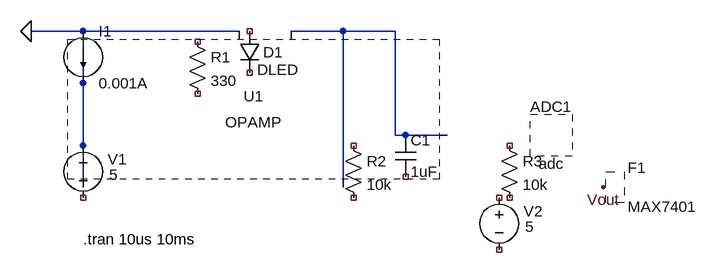
[diagram p0: schematic simv2.asc]
simv2.asc, the LTspice schematic file:
Version 4
SHEET 1 880 680
WIRE -240 0 -320 0
WIRE 0 0 -240 0
WIRE 160 0 80 0
WIRE 240 0 160 0
WIRE -240 160 -240 0
WIRE 160 160 160 0
WIRE 240 160 240 0
WIRE 320 160 240 160
WIRE -240 240 -240 160
WIRE 160 240 160 160
FLAG -320 0 0
SYMBOL voltage -240 160 R0
WINDOW 0 38 37 Left 0
WINDOW 3 40 61 Left 0
SYMATTR InstName V1
SYMATTR Value 5
SYMBOL res -80 0 R0
SYMATTR InstName R1
SYMATTR Value 330
SYMBOL diode 0 0 R0
WINDOW 0 37 32 Left 0
WINDOW 3 28 59 Left 0
SYMATTR InstName D1
SYMATTR Value DLED
SYMBOL current -240 0 R0
SYMATTR InstName I1
SYMATTR Value 0.001A
SYMBOL res 160 160 R0
SYMATTR InstName R2
SYMATTR Value 10k
SYMBOL cap 240 160 R0
SYMATTR InstName C1
SYMATTR Value 1uF
SYMBOL opamp 320 160 R0
SYMATTR InstName U1
SYMATTR Value OPAMP
SYMBOL res 400 160 R0
SYMATTR InstName R3
SYMATTR Value 10k
SYMBOL voltage 400 240 R0
WINDOW 0 38 37 Left 0
WINDOW 3 40 61 Left 0
SYMATTR InstName V2
SYMATTR Value 5
SYMBOL adc 480 160 R0
SYMATTR InstName ADC1
SYMBOL filter 560 160 R0
SYMATTR InstName F1
SYMATTR Value MAX7401
FLAG 560 240 Vout
TEXT -240 320 Left 0 !.tran 10us 10ms

The netlist it stands for:
* simv2.asc
V1 0 NC_01 5
R1 NC_02 NC_03 330
D1 NC_04 NC_05 DLED
I1 0 0 0.001A
R2 NC_06 NC_07 10k
C1 N001 NC_08 1uF
* U1: OPAMP (symbol opamp not available, pin order unknown); nets seen at it: 0, N001
R3 NC_09 NC_10 10k
V2 NC_11 NC_12 5
* ADC1: adc (symbol adc not available, pin order unknown); nets seen at it: 
* F1: MAX7401 (symbol filter not available, pin order unknown); nets seen at it: Vout
.model D D
.lib standard.dio
.tran 10us 10ms
.backanno
.end